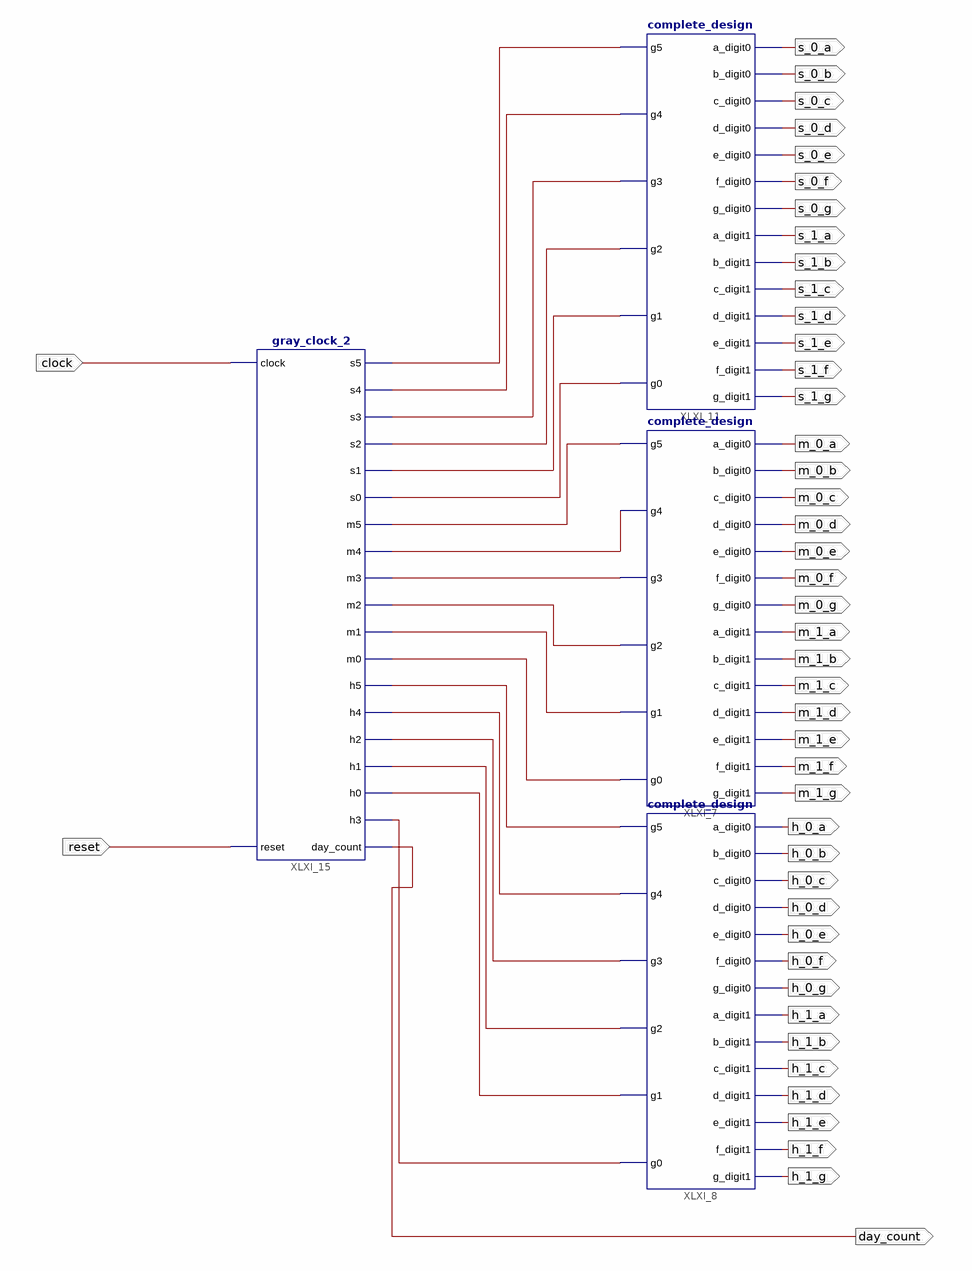
[diagram p0: schematic sheet 1]
// Xilinx ISE schematic seven_segment_counter.sch (spartan6) as structural Verilog: 4 symbols, 45 ports
module seven_segment_counter (
  input  clock,
  input  reset,
  output s_0_a,
  output s_0_b,
  output s_0_c,
  output s_0_d,
  output s_0_e,
  output s_0_f,
  output s_0_g,
  output s_1_a,
  output s_1_b,
  output s_1_c,
  output s_1_d,
  output s_1_e,
  output s_1_f,
  output s_1_g,
  output m_0_a,
  output m_0_b,
  output m_0_c,
  output m_0_d,
  output m_0_e,
  output m_0_f,
  output m_0_g,
  output m_1_a,
  output m_1_b,
  output m_1_c,
  output m_1_d,
  output m_1_e,
  output m_1_f,
  output m_1_g,
  output h_0_a,
  output h_0_b,
  output h_0_c,
  output h_0_d,
  output h_0_e,
  output h_0_f,
  output h_0_g,
  output h_1_a,
  output h_1_b,
  output h_1_c,
  output h_1_d,
  output h_1_e,
  output h_1_f,
  output h_1_g,
  output day_count
);

  wire XLXN_2, XLXN_3, XLXN_4, XLXN_5, XLXN_7, XLXN_8, XLXN_11, XLXN_12, XLXN_14, XLXN_15, XLXN_16, XLXN_17,
       XLXN_18, XLXN_19, XLXN_23, XLXN_24, XLXN_33, XLXN_37;

  complete_design XLXI_7 (
    .g5(XLXN_7), .g4(XLXN_8), .g3(XLXN_24), .g2(XLXN_33), .g1(XLXN_11), .g0(XLXN_12), .a_digit0(m_0_a),
    .b_digit0(m_0_b), .c_digit0(m_0_c), .d_digit0(m_0_d), .e_digit0(m_0_e), .f_digit0(m_0_f),
    .g_digit0(m_0_g), .a_digit1(m_1_a), .b_digit1(m_1_b), .c_digit1(m_1_c), .d_digit1(m_1_d),
    .e_digit1(m_1_e), .f_digit1(m_1_f), .g_digit1(m_1_g));
  complete_design XLXI_8 (
    .g5(XLXN_14), .g4(XLXN_15), .g3(XLXN_16), .g2(XLXN_17), .g1(XLXN_18), .g0(XLXN_19), .a_digit0(h_0_a),
    .b_digit0(h_0_b), .c_digit0(h_0_c), .d_digit0(h_0_d), .e_digit0(h_0_e), .f_digit0(h_0_f),
    .g_digit0(h_0_g), .a_digit1(h_1_a), .b_digit1(h_1_b), .c_digit1(h_1_c), .d_digit1(h_1_d),
    .e_digit1(h_1_e), .f_digit1(h_1_f), .g_digit1(h_1_g));
  complete_design XLXI_11 (
    .g5(XLXN_23), .g4(XLXN_2), .g3(XLXN_3), .g2(XLXN_4), .g1(XLXN_5), .g0(XLXN_37), .a_digit0(s_0_a),
    .b_digit0(s_0_b), .c_digit0(s_0_c), .d_digit0(s_0_d), .e_digit0(s_0_e), .f_digit0(s_0_f),
    .g_digit0(s_0_g), .a_digit1(s_1_a), .b_digit1(s_1_b), .c_digit1(s_1_c), .d_digit1(s_1_d),
    .e_digit1(s_1_e), .f_digit1(s_1_f), .g_digit1(s_1_g));
  gray_clock_2 XLXI_15 (
    .clock(clock), .reset(reset), .s5(XLXN_23), .s4(XLXN_2), .s3(XLXN_3), .s2(XLXN_4), .s1(XLXN_5),
    .s0(XLXN_37), .m5(XLXN_7), .m4(XLXN_8), .m3(XLXN_24), .m2(XLXN_33), .m1(XLXN_11), .m0(XLXN_12),
    .h5(XLXN_14), .h4(XLXN_15), .h2(XLXN_16), .h1(XLXN_17), .h0(XLXN_18), .h3(XLXN_19), .day_count(day_count));
endmodule
